# Altium schematic sheet LEDDriver.SchDoc
size A4
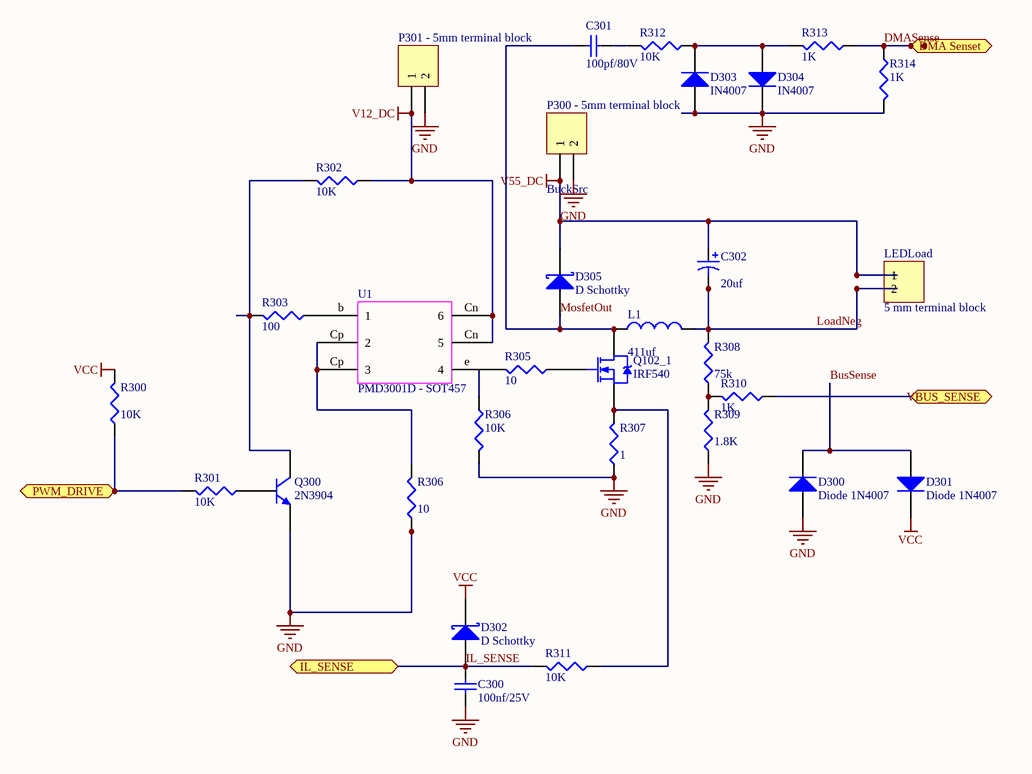
[diagram p0: LEDDriver.SchDoc]

## Parts
(Parts that share a designator on the sheet are numbered #1, #2 ... from top to bottom, then left to right.)
C300  100nf/25V  [CC3225-1210]
C301  100pf/80V  [CC3225-1210]
C302  value 20uf  [CAPPR2.5-6.3x5]  (hidden comment: 22uf/16v)
D300  Diode 1N4007  [DO-41]
D301  Diode 1N4007  [DO-41]
D302  D Schottky  [SMB]
D303  IN4007  [DO-41]
D304  IN4007  [DO-41]
D305  D Schottky  [SMB]
L1  value 411uf  [pitch 7mm]  (hidden comment: Inductor 411uH - pitch 7mm)
LEDLoad  5 mm terminal block  [HDR1X2]
P300_-_5mm_terminal_block  BuckSrc  [HDR1X2]
P301_-_5mm_terminal_block  (no value)  [HDR1X2]
Q102_1  IRF540  [TO-220AB]
Q300  2N3904  [TO-92A]
R300  value 10K  [CR3216-1206]  (hidden comment: CR3216-1206)
R301  value 10K  [CR3216-1206]  (hidden comment: CR3216-1206)
R302  value 10K  [CR3216-1206]  (hidden comment: CR3216-1206)
R303  value 100  [CR3216-1206]  (hidden comment: CR3216-1206)
R305  value 10  [CR3216-1206]  (hidden comment: CR3216-1206)
R306#1  value 10K  [CR3216-1206]  (hidden comment: CR3216-1206)
R306#2  value 10  [CR3216-1206]  (hidden comment: CR3216-1206)
R307  value 1  [CR3216-1206]  (hidden comment: CR3216-1206)
R308  value 75k  [CR3216-1206]  (hidden comment: CR3216-1206)
R309  value 1.8K  [CR3216-1206]  (hidden comment: CR3216-1206)
R310  value 1K  [CR3216-1206]  (hidden comment: CR3216-1206)
R311  value 10K  [CR3216-1206]  (hidden comment: 8-Jun-2000)
R312  value 10K  [CR3216-1206]  (hidden comment: 8-Jun-2000)
R313  value 1K  [CR3216-1206]  (hidden comment: 8-Jun-2000)
R314  value 1K  [CR3216-1206]  (hidden comment: 8-Jun-2000)
U1  PMD3001D - SOT457  [SOT 457]

## Ports
DMA Senset, IL_SENSE, PWM_DRIVE, VBUS_SENSE

## Nets
GND: C300.1 D300.1(A) D303.1(A) D304.2(K) P300_-_5mm_terminal_block.2 P301_-_5mm_terminal_block.2 Q300.1(E) R306#1.2 R306#2.1 R307.1 R309.1 R314.2
V12_DC: P301_-_5mm_terminal_block.1 R302.1 U1.Cn(6)
V55_DC: C302.1 D305.2(K) LEDLoad.1 P300_-_5mm_terminal_block.1
VCC: D301.2(K) D302.2(K) R300.2
BusSense: D300.2(K) D301.1(A)
DMASense: R313.1 R314.1 ; port DMA Senset
IL_SENSE: C300.2 D302.1(A) R311.2 ; port IL_SENSE
LoadNeg: C302.2 L1.2 LEDLoad.2 R308.2
MosfetOut: C301.2 D305.1(A) L1.1 Q102_1.2(D)
PWM_DRIVE: R300.1 R301.2 ; port PWM_DRIVE
VBUS_SENSE: R310.1 ; port VBUS_SENSE
NetC301_1: C301.1 R312.2
NetD303_2: D303.2(K) D304.1(A) R312.1 R313.2
NetQ102_1_1: Q102_1.1(G) R305.1
NetQ102_1_3: Q102_1.3(S) R307.2 R311.1
NetQ300_2: Q300.2(B) R301.1
NetQ300_3: Q300.3(C) R302.2 R303.2
NetR303_1: R303.1 U1.b(1)
NetR305_2: R305.2 U1.e(4)
NetR306#2_2: R306#2.2 U1.Cp(2)
NetR308_1: R308.1 R309.2 R310.2

Not connected (* = marked no-connect by the designer): R306#1 1

## Library data of the parts
C300 = Cap: Capacitor; Value: 100nf; Published: 8-Jun-2000; LatestRevisionDate: 17-Jul-2002; LatestRevisionNote: Re-released for DXP Platform.; PackageReference: RAD-0.3; Publisher: Altium Limited; PackageDescription: Radial Cap, Thru-Hole; 2 Leads; 0.3 in Pin Spacing
C301 = Cap: Capacitor; Value: 100pf; Published: 8-Jun-2000; LatestRevisionDate: 17-Jul-2002; LatestRevisionNote: Re-released for DXP Platform.; PackageReference: RAD-0.3; Publisher: Altium Limited; PackageDescription: Radial Cap, Thru-Hole; 2 Leads; 0.3 in Pin Spacing
C302 = Cap Pol1: Polarized Capacitor (Radial); Published: 8-Jun-2000; LatestRevisionDate: 17-Jul-2002; LatestRevisionNote: Re-released for DXP Platform.; PackageReference: RB7.6-15; Publisher: Altium Limited; PackageDescription: Polarized Capacitor (Radial); 2 Leads
D300 D301 D303 D304 = Diode 1N4007: 1 Amp General Purpose Rectifier; Published: 8-Jun-2000; LatestRevisionDate: 17-Jul-2002; LatestRevisionNote: Re-released for DXP Platform.; DatasheetVersion: 1998; PackageVersion: Aug-1999; PackageReference: DO-41; Publisher: Altium Limited; PackageDescription: Diode, Axial; Body 5.2 x 2.7 mm (LxDia. max), Lead Dia. 0.86 mm (max); Code_JEDEC: DO-204-AL; ComponentLink1Description: Manufacturer Link; ComponentLink1URL: http://www.fairchildsemi.com/; ComponentLink2Description: Datasheet; ComponentLink2URL: http://www.fairchildsemi.com/ds/1N%2F1N4001.pdf
D302 D305 = D Schottky: Schottky Diode; Published: 8-Jun-2000; LatestRevisionDate: 17-Jul-2002; LatestRevisionNote: Re-released for DXP Platform.; PackageReference: SMB; Publisher: Altium Limited; PackageDescription: DO-214-AA/SMB; 2 C-Bend Leads; Body 5.3 x 3.6 mm, inc. leads (LxW); Code_JEDEC: DO-214-AA
L1 = Inductor: Code_IEC: 1005; Published: 8-Jun-2000; LatestRevisionDate: 29-May-2009; LatestRevisionNote: IPC-7351 Footprint Added.; PackageReference: 0402-A; Publisher: Altium Limited; PackageDescription: Chip Inductor; Code_JEITA: 0402
LEDLoad P300_-_5mm_terminal_block P301_-_5mm_terminal_block = Header 2: Header, 2-Pin; LatestRevisionDate: 17-Jul-2002; LatestRevisionNote: Re-released for DXP Platform.; Publisher: Altium Limited
Q102_1 = IRF540: HEXFET N-Channel Power MOSFET; Note: Pin 2 is electrically connected to pin 4.; Published: 8-Jun-2000; LatestRevisionDate: 17-Jul-2002; LatestRevisionNote: Re-released for DXP Platform.; DatasheetVersion: PD-9.373H; PackageVersion: Feb-1997; PackageReference: TO-220AB; Publisher: Altium Limited; PackageDescription: TO, Thru-Hole, Vertical, Heatsink Mounted; 3 In-Line Leads; Pitch 2.54 mm; ComponentLink1Description: Manufacturer Link; ComponentLink1URL: http://www.irf.com/
Q300 = 2N3904: NPN General Purpose Amplifier; Published: 8-Jun-2000; LatestRevisionDate: 15-Jan-2003; LatestRevisionNote: PCB Footprint 'BCY-W3/D4.7' replaced; DatasheetVersion: 1997; PackageVersion: Sep-1998; PackageReference: TO-92A; Publisher: Altium Limited; PackageDescription: TO, Flat Index; 3 In-Line, Axial Leads; Body Dia. 4.5mm; Leads 0.51 x 0.48 mm (max); ComponentLink1Description: Manufacturer Link; ComponentLink1URL: http://www.fairchildsemi.com/; ComponentLink2Description: Datasheet; ComponentLink2URL: http://www.fairchildsemi.com/ds/2N%2F2N3904.pdf
R300-R303 R305 R306#1 R306#2 R307-R314 = Res3: Resistor; Published: 8-Jun-2000; LatestRevisionDate: 29-May-2009; LatestRevisionNote: IPC-7351 Footprint Added.; PackageReference: CR3216-1206; Publisher: Altium Limited; PackageDescription: Chip Resistor
U1 = Component_1